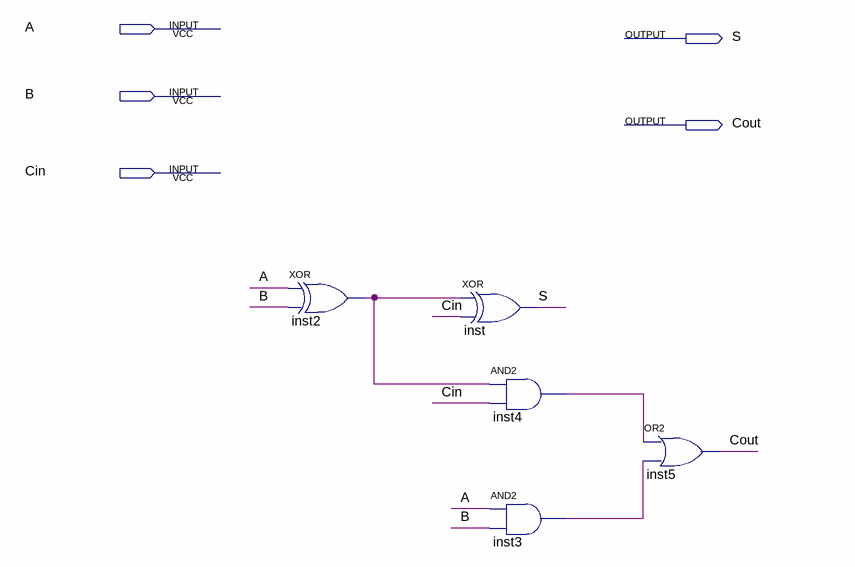
[diagram p0: schematic sheet]
// Quartus schematic FA.bdf as structural Verilog: 5 symbols, 5 pins
module FA (
  input  A,
  input  B,
  input  Cin,
  output S,
  output Cout
);

  wire inst2_out, inst3_out, inst4_out;

  xor inst2 (inst2_out, A, B);
  xor inst (S, inst2_out, Cin);
  and inst4 (inst4_out, inst2_out, Cin);
  and inst3 (inst3_out, A, B);
  or inst5 (Cout, inst4_out, inst3_out);
endmodule
